# Altium schematic sheet totem.SchDoc
size A4; SheetNumber: 2; SheetTotal: 6
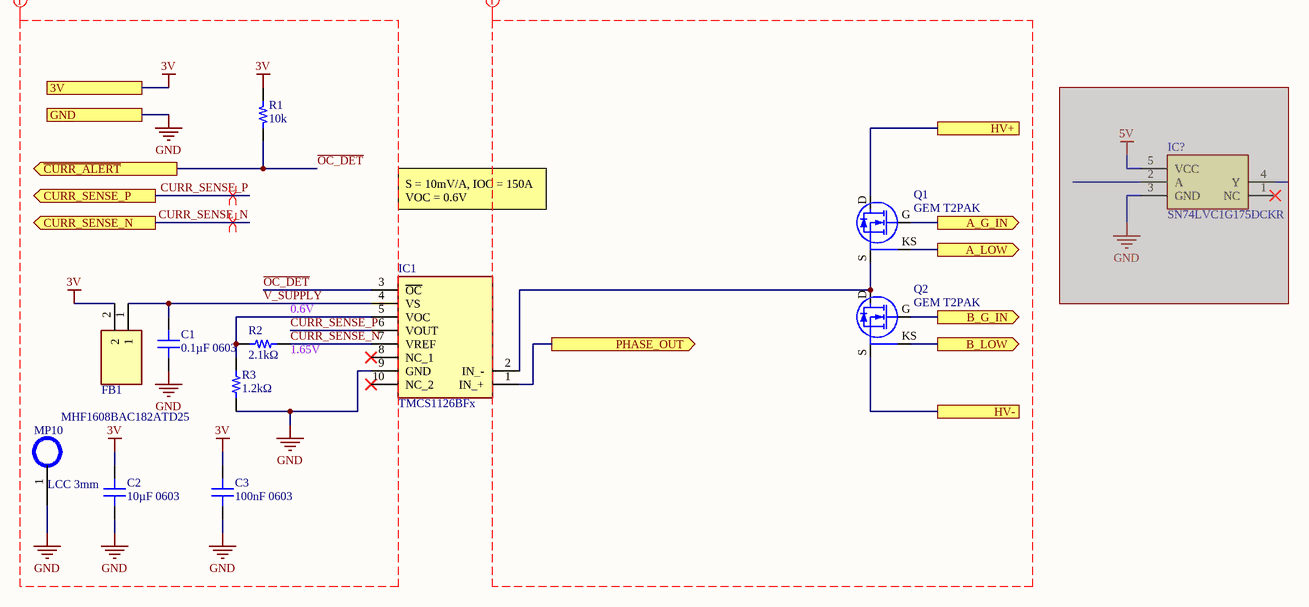
[diagram p0: totem.SchDoc]

## Parts
C1  0.1µF 0603  [0µF 0603-Footprint-1]
C2  10µF 0603  [0µF 0603-Footprint-1]
C3  100nF 0603  [0µF 0603-Footprint-1]
FB1  MHF1608BAC182ATD25  [BEADC1608X95N]
IC1  TMCS1126BFx  [TMCS1126ADxQ1]
IC?  SN74LVC1G175DCKR  [SOP65P210X110-6N]  (masked out: inside a compile mask, not in the netlist)
MP10  LCC 3mm  [PAD 3MM]
Q1  GEM T2PAK  [GEM T2PAK H3.6]
Q2  GEM T2PAK  [GEM T2PAK H3.6]
R1  10k  [RES 0603_1608]
R2  2.1kΩ  [RES 0603_1608]
R3  1.2kΩ  [RES 0603_1608]

## Ports
3V, A_G_IN (out), A_LOW (out), B_G_IN (out), B_LOW (out), CURR_SENSE_N (out), CURR_SENSE_P (out), GND, HV+, HV-, PHASE_OUT (out), ~{CURR_ALERT} (out)

## Nets
3V: C2.2 C3.2 FB1.2 R1.2 ; port 3V
GND: C1.1 C2.1 C3.1 IC1.9(GND) MP10.1 R3.2 ; port GND
~{OC_DET}: IC1.3(~{OC}) R1.1 ; port ~{CURR_ALERT}
A_G_IN: Q1.G ; port A_G_IN
A_LOW: Q1.KS ; port A_LOW
B_G_IN: Q2.G ; port B_G_IN
B_LOW: Q2.KS ; port B_LOW
CURR_SENSE_N: IC1.7(VREF) R2.1 ; port CURR_SENSE_N
CURR_SENSE_P: IC1.6(VOUT) ; port CURR_SENSE_P
HV+: Q1.D ; port HV+
HV-: Q2.S ; port HV-
PHASE_OUT: IC1.1(IN_+) ; port PHASE_OUT
V_SUPPLY: C1.2 FB1.1 IC1.4(VS)
NetIC1_2: IC1.2(IN_-) Q1.S Q2.D
NetIC1_5: IC1.5(VOC) R2.2 R3.1

Not connected (* = marked no-connect by the designer): IC1 8(NC_1)* 10(NC_2)*

## Layout directives
differential pair: CURR_SENSE_N, CURR_SENSE_P
net class LV: 3V, CURR_SENSE_N, CURR_SENSE_P, GND, V_SUPPLY, ~{OC_DET}
net class HV: (no net found under the mark)

## Notes on the sheet
- S = 10mV/A, IOC = 150A
  VOC = 0.6V
- (near R2) 0.6V
- (near R2) 1.65V
- MY
- 25
- Project:
- Author
- Revision
- Sheet
- Modified
- of

## Library data of the parts
C1-C3 = CMP-714-000037-1: Generic 0603 Capacitor; ComponentLink2Description: DigiKey Link; ComponentLink1Description: Datasheet
FB1 = MHF1608BAC182ATD25: Filter; Manufacturer_Name: TDK; Datasheet Link: https://product.tdk.com/system/files/dam/doc/product/emc/emc/suppression-filter/catalog/suppression-filter_automotive_mhf1608_en.pdf; Height: 0.95mm; Manufacturer_Part_Number: MHF1608BAC182ATD25; Mouser Part Number: 810-MHF1608BAC182ATD; Mouser Price/Stock: https://www.mouser.co.uk/ProductDetail/TDK/MHF1608BAC182ATD25?qs=sPbYRqrBIVkck8qVgrG13Q%3D%3D; Arrow Part Number: MHF1608BAC182ATD25; Arrow Price/Stock: https://www.arrow.com/en/products/mhf1608bac182atd25/tdk?region=europe
IC1 = TMCS1126ADx-Q1: Integrated Circuit; Manufacturer_Name: Texas Instruments; Datasheet Link: https://www.ti.com/lit/ds/symlink/tmcs1126-q1.pdf?ts=1750416569069&ref_url=https%253A%252F%252Fwww.ti.com%252Fproduct%252FTMCS1126-Q1; Height: 2.65mm; Manufacturer_Part_Number: TMCS1126ADx-Q1
IC? = SN74LVC1G175DCKR: Integrated Circuit; Manufacturer_Name: Texas Instruments; Datasheet Link: http://www.ti.com/lit/gpn/sn74lvc1g175; Height: 1.1mm; Manufacturer_Part_Number: SN74LVC1G175DCKR; Mouser Part Number: 595-SN74LVC1G175DCKR; Mouser Price/Stock: https://www.mouser.co.uk/ProductDetail/Texas-Instruments/SN74LVC1G175DCKR?qs=pajgIaoyDUjI2BH1x6CpqQ%3D%3D; Arrow Part Number: SN74LVC1G175DCKR; Arrow Price/Stock: https://www.arrow.com/en/products/sn74lvc1g175dckr/texas-instruments?region=nac
R1 = RNCS0603BKE10K0: RES 10K OHM 0.1% 1/16W 0603; Manufacturer: Stackpole Electronics Inc; Value: 1k; Power (Watts): 0.063W, 1/16W; Resistance: 10 kOhms; Temperature Coefficient: ±25ppm/°C; Part Number: RNCS0603BKE10K0; ComponentLink1Description: Datasheet; ComponentLink1URL: https://www.seielect.com/catalog/sei-rncs_rnch.pdf; ComponentLink2Description: DigiKey Link; ComponentLink2URL: https://www.digikey.com/en/products/detail/stackpole-electronics-inc/RNCS0603BKE10K0/1708836; Composition: Thin Film; Device Package: 0603 (1608 Metric); Features: Anti-Corrosive, Automotive AEC-Q200, Moisture Resistant; Height - Seated (Max): 0.022" (0.55mm); LastUpdated: 2/9/2024 8:43:37 PM; Lifecycle Status: Active; Minimum Order: 1; Number of Terminations: 2; Operating Temperature: -55°C ~ 155°C; Package / Case: 0603 (1608 Metric); Packaging: TapeAndReel; PartId: 4838; Part Status: Active; Price: 0.06; Ratings: AEC-Q200; Series: RNCS; Size / Dimension: 0.061" L x 0.031" W (1.55mm x 0.80mm); Supplier 1: DigiKey; Supplier Part Number 1: RNCS0603BKE10K0CT-ND; Supplier Device Package: 0603; Tolerance: ±0.1%
R2 R3 = CMP-650-000035-3: Generic 0603 Resistor